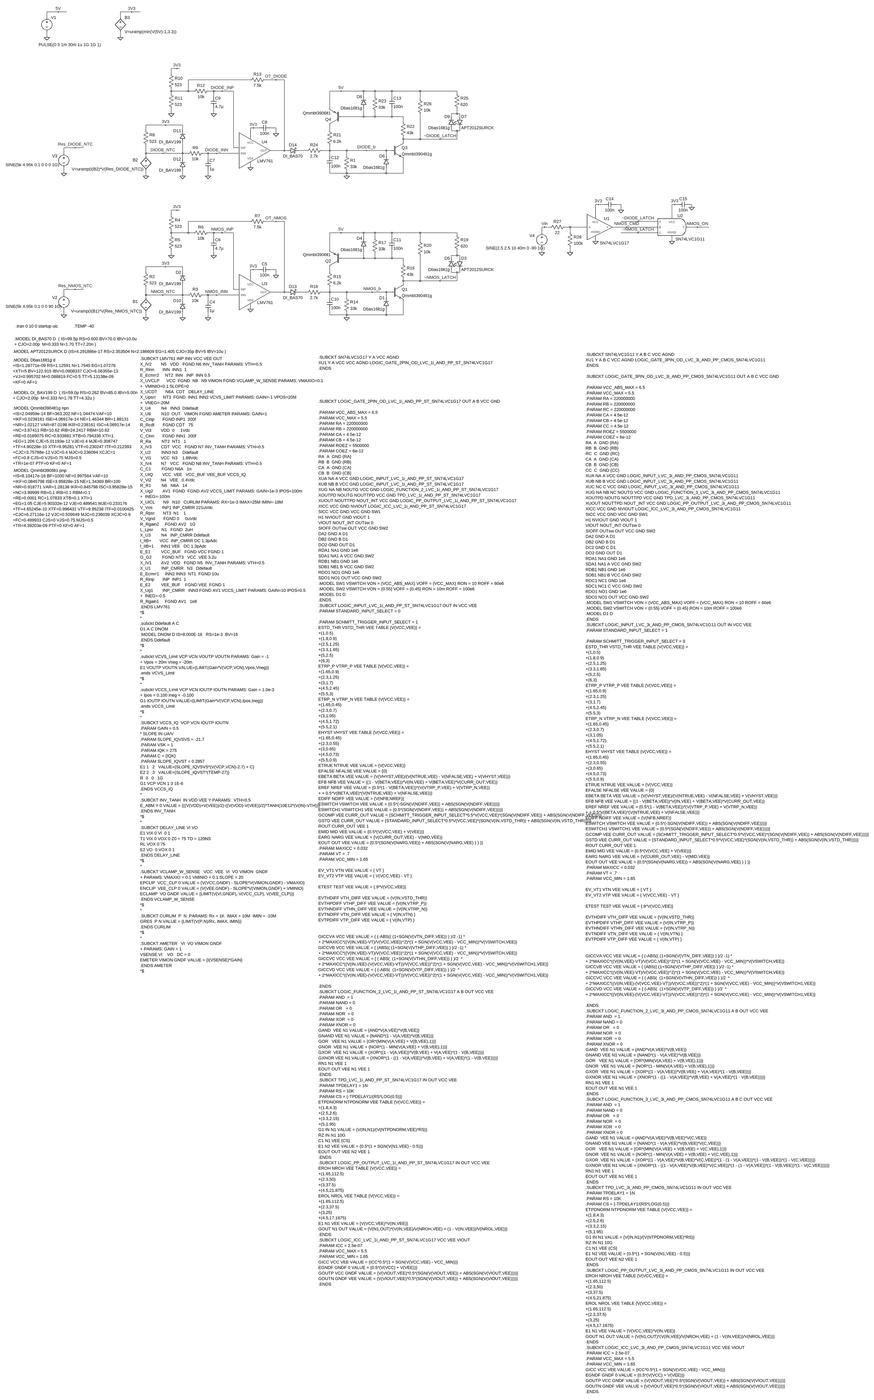
[diagram p0: schematic Big_Fast_Switch.asc, whole sheet]
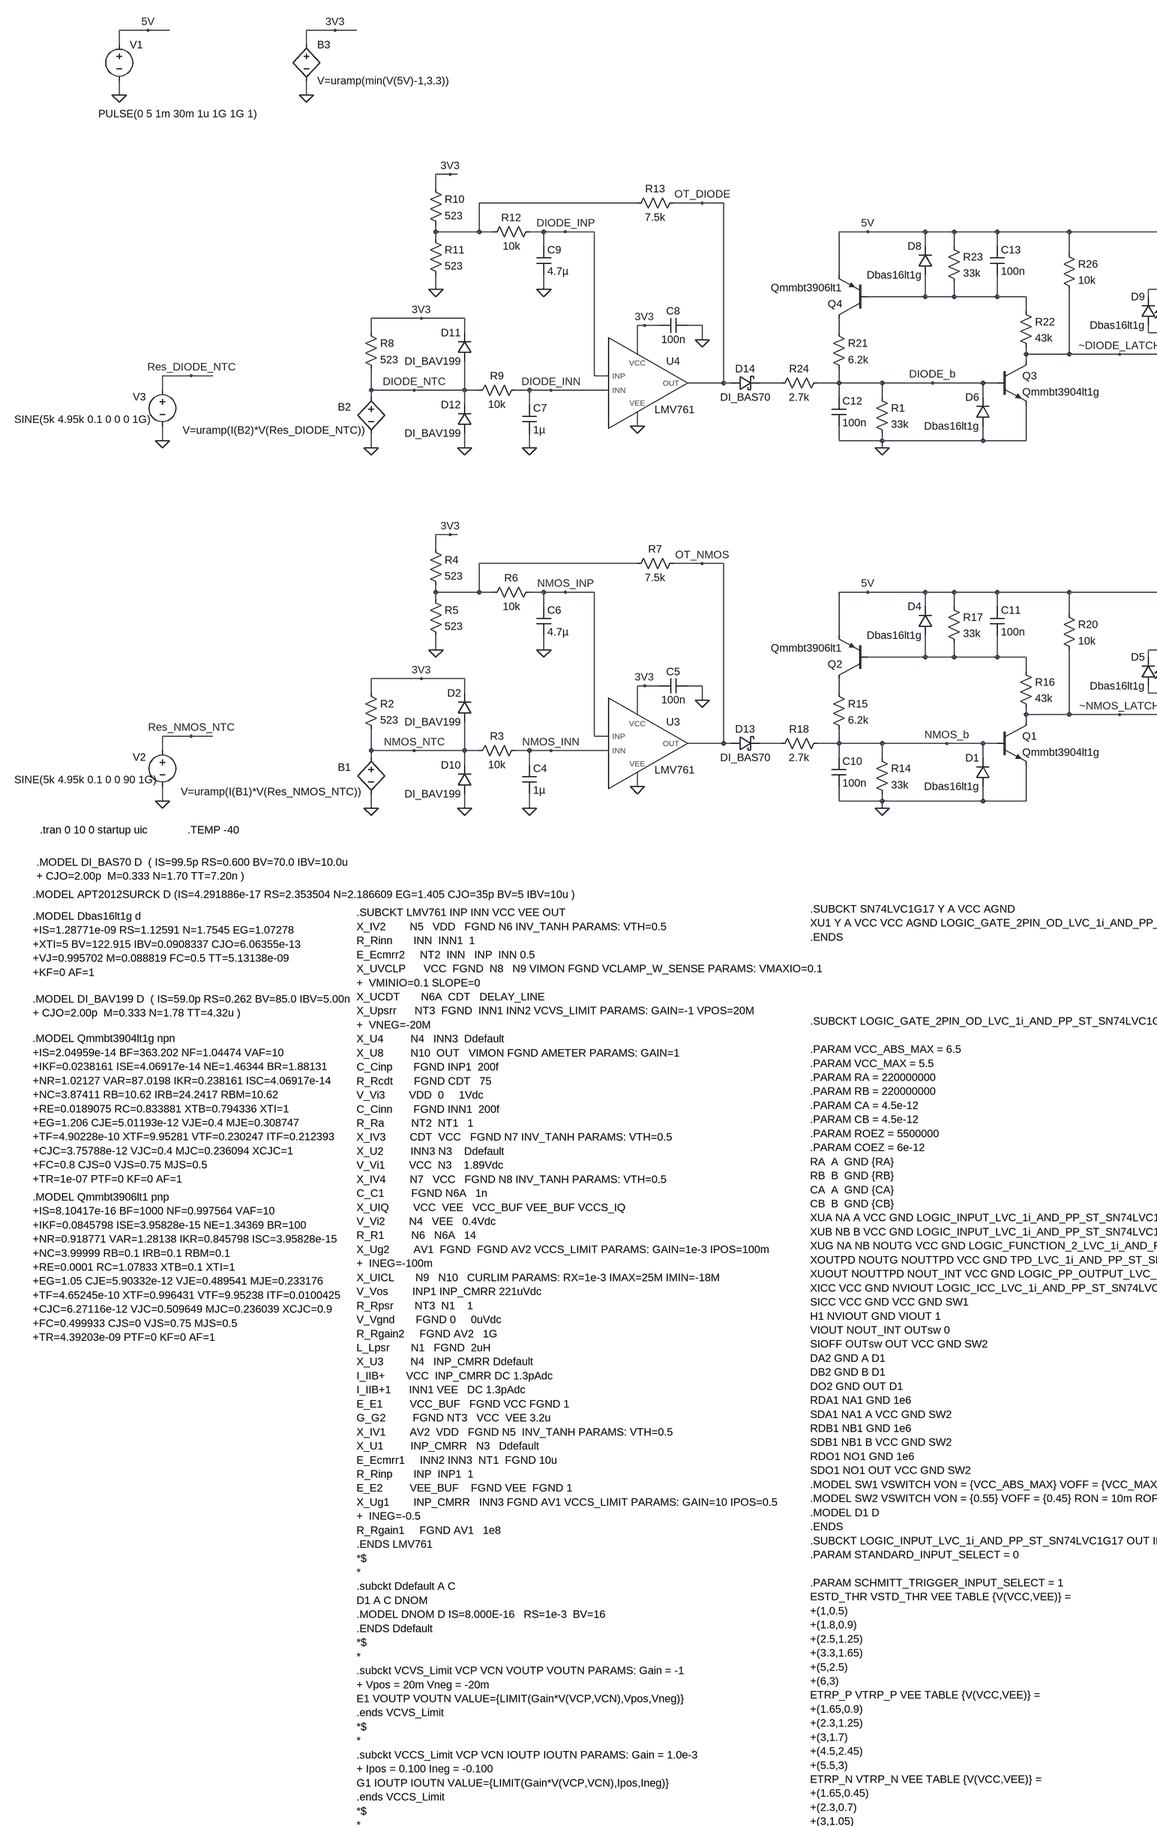
[diagram p1: schematic Big_Fast_Switch.asc, part, row 1 of 2, column 1 of 2]
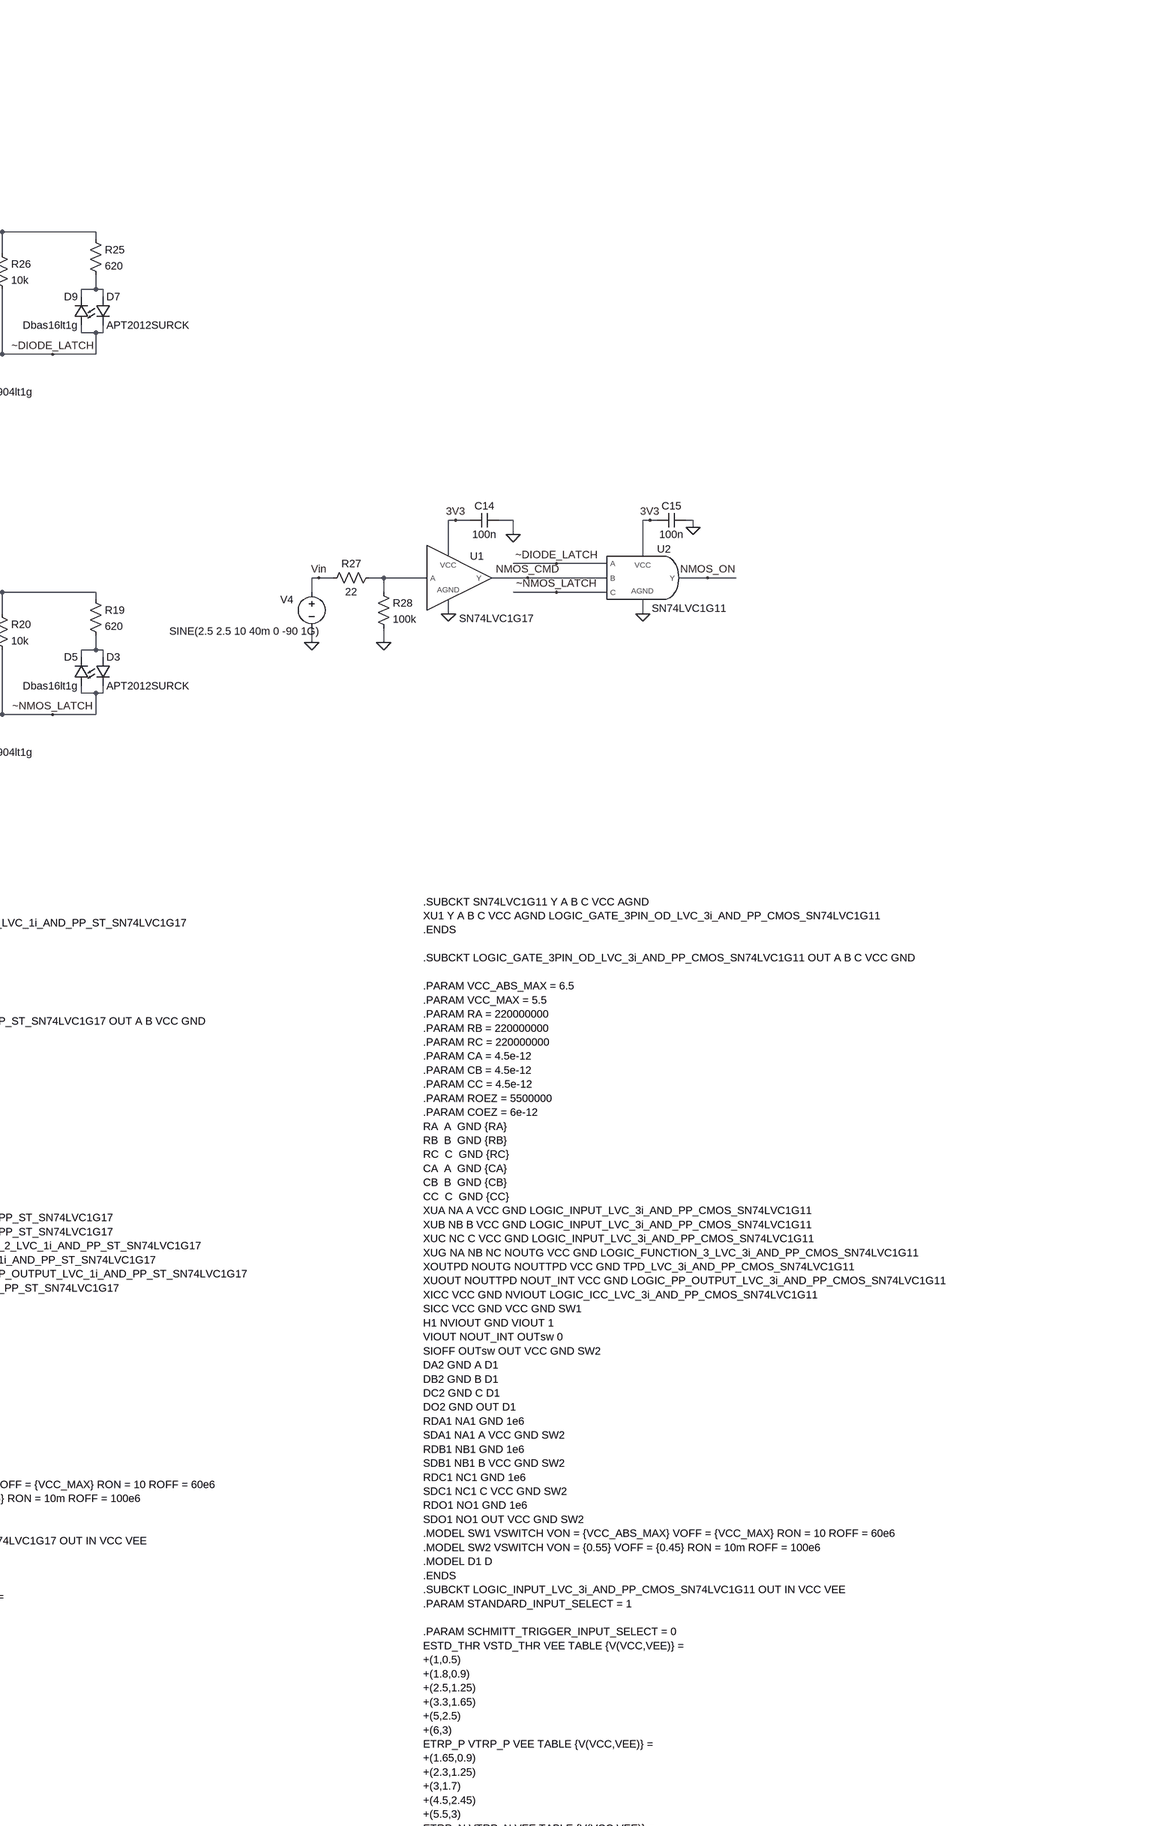
[diagram p2: schematic Big_Fast_Switch.asc, part, row 1 of 2, column 2 of 2]
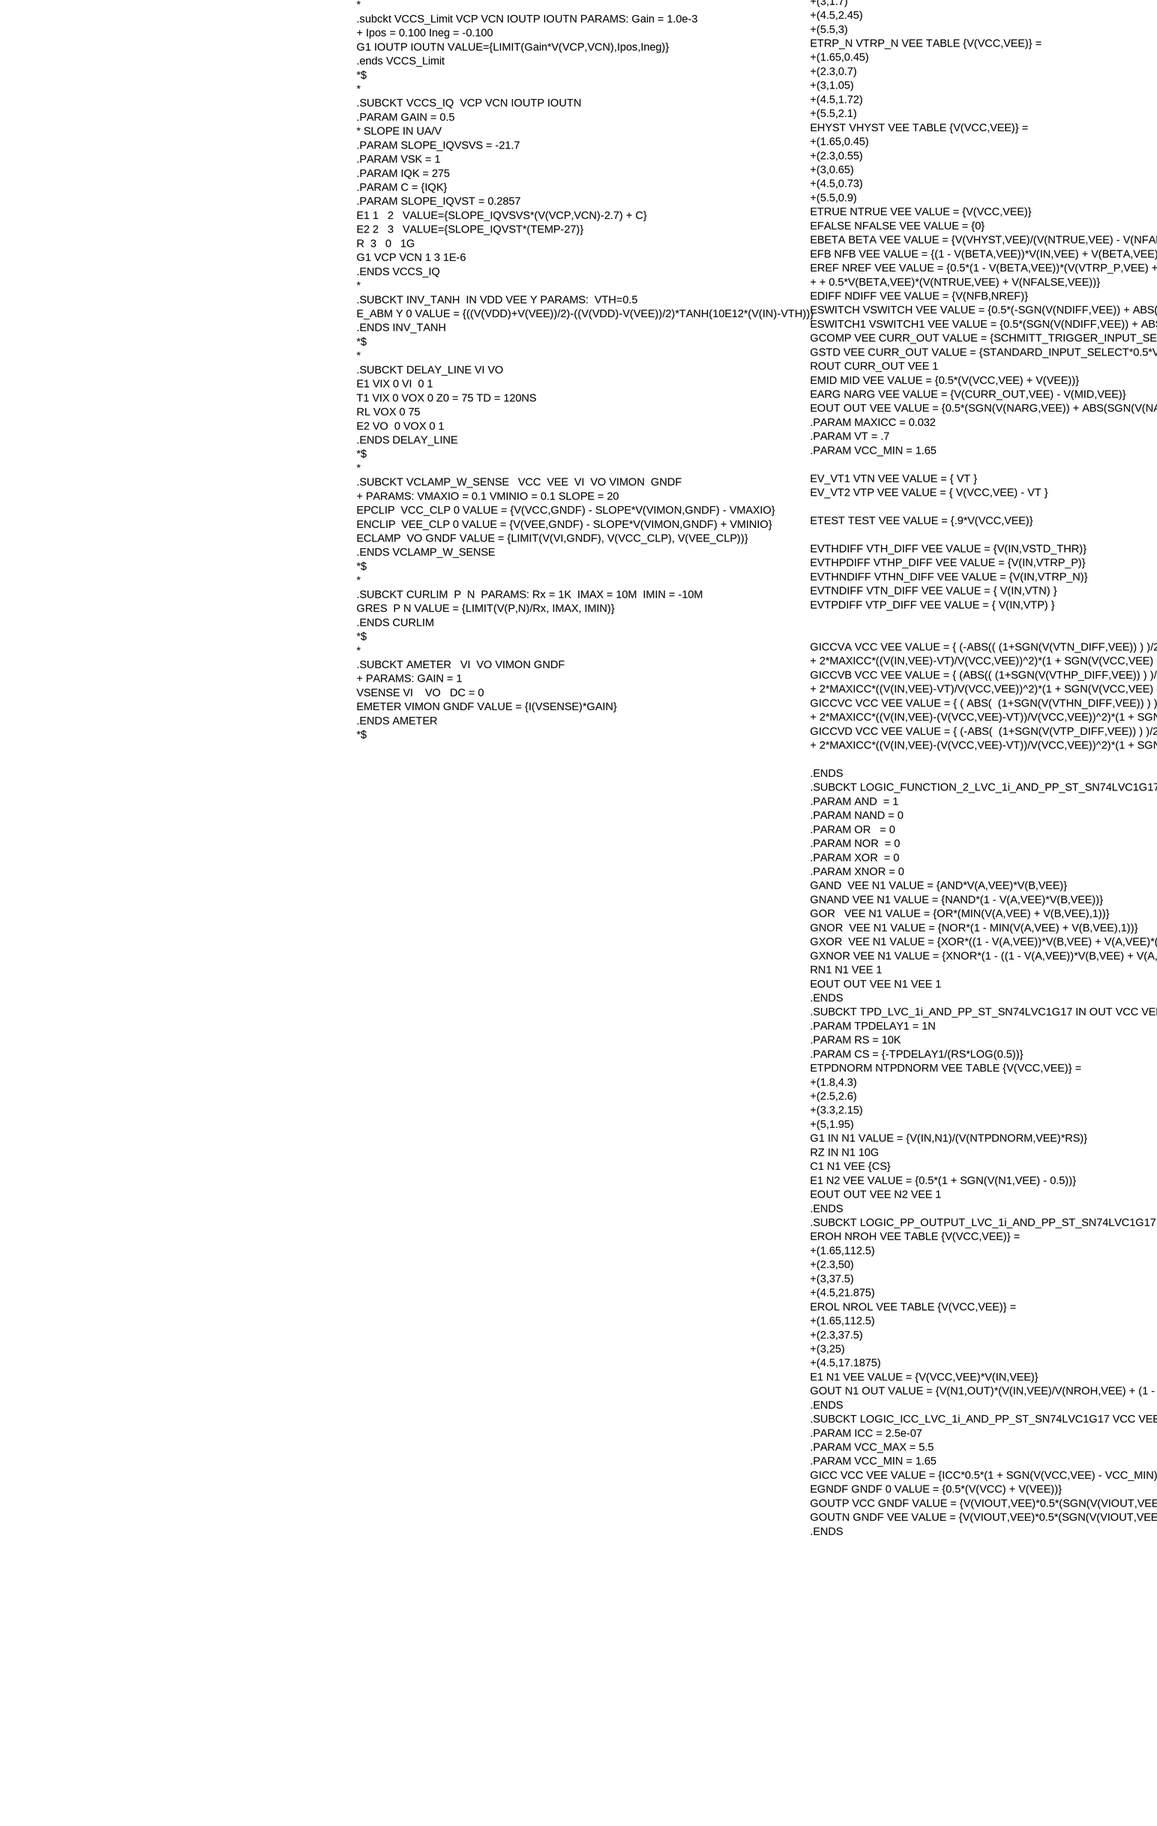
[diagram p3: schematic Big_Fast_Switch.asc, part, row 2 of 2, column 1 of 2]
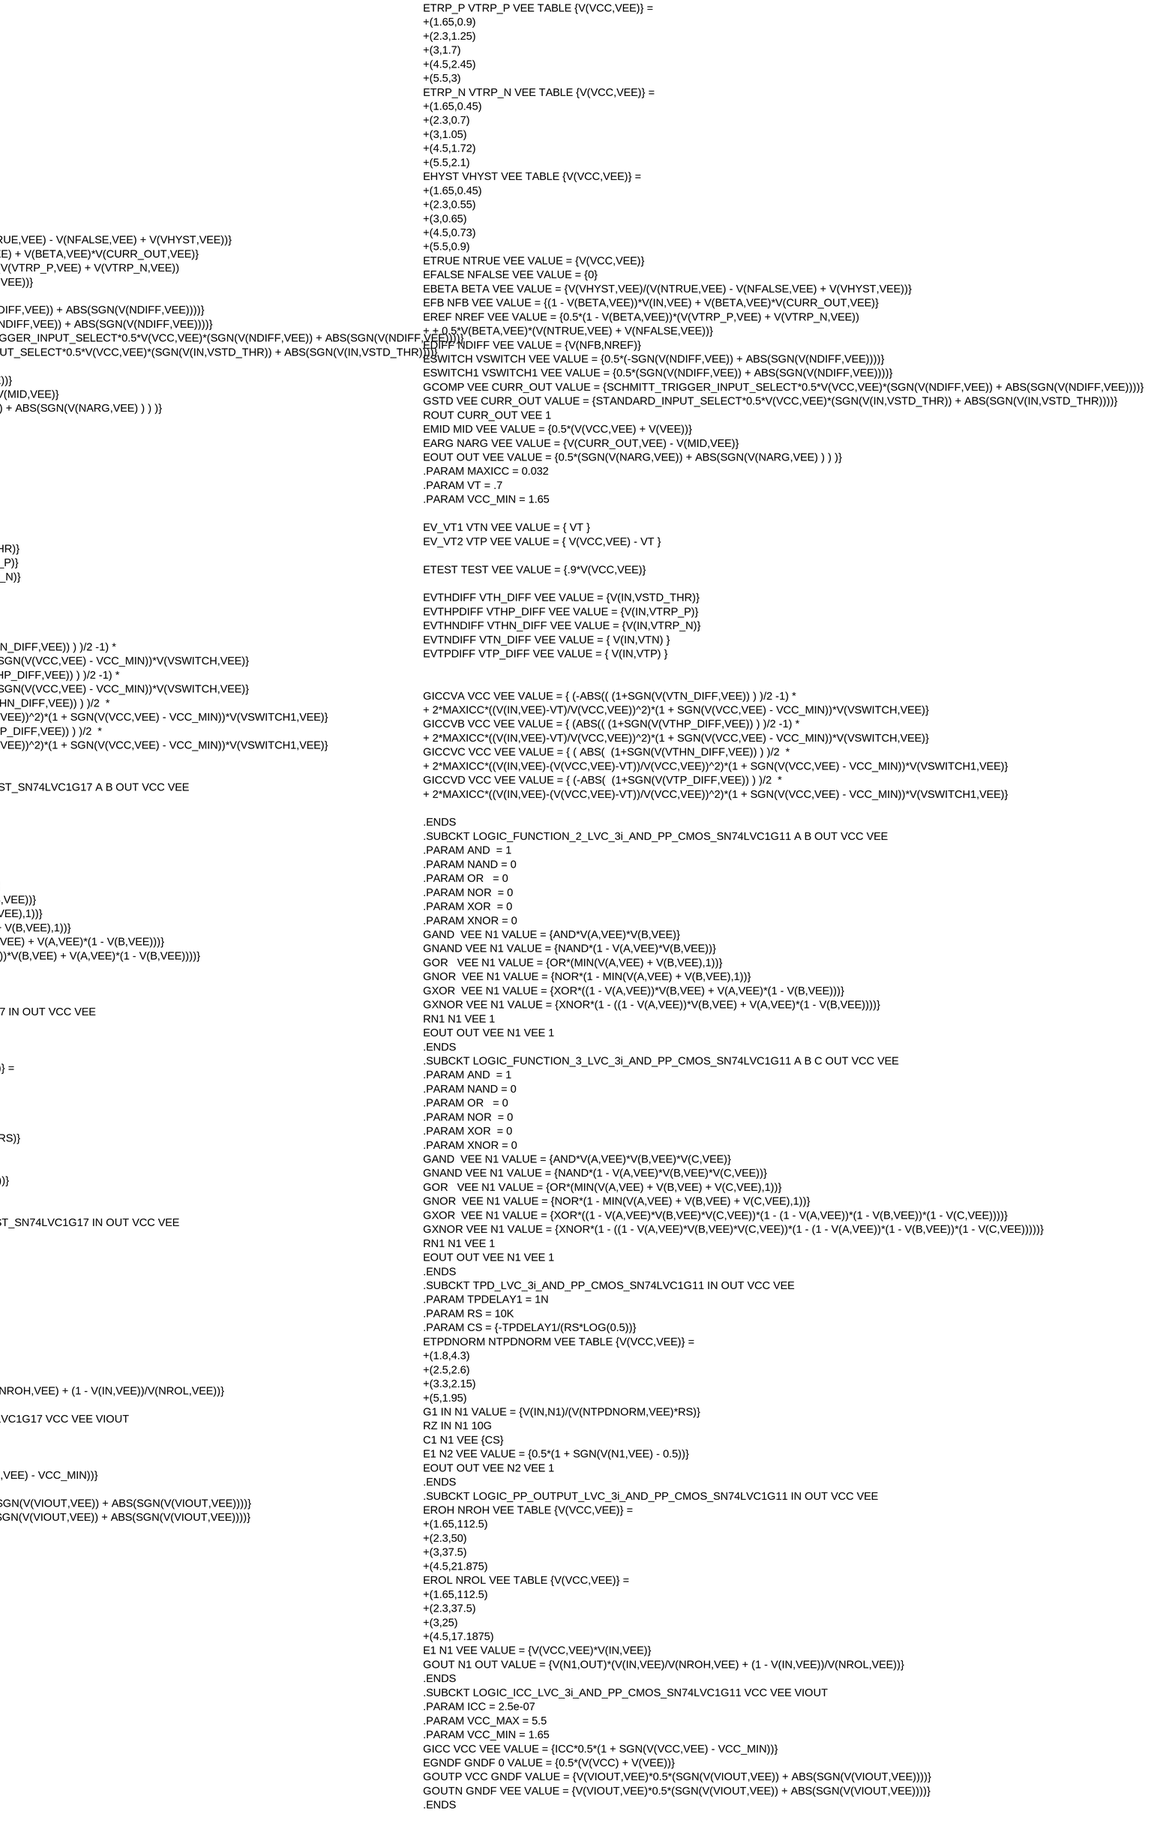
[diagram p4: schematic Big_Fast_Switch.asc, part, row 2 of 2, column 2 of 2]
* Big_Fast_Switch.asc
D1 0 NMOS_b Dbas16lt1g
D2 NMOS_NTC 3V3 DI_BAV199
Q1 ~NMOS_LATCH NMOS_b 0 0 Qmmbt3904lt1g
Q2 N010 N009 5V 0 Qmmbt3906lt1
D3 N008 ~NMOS_LATCH APT2012SURCK
D4 N009 5V Dbas16lt1g
D5 ~NMOS_LATCH N008 Dbas16lt1g
D10 0 NMOS_NTC DI_BAV199
V1 5V 0 PULSE(0 5 1m 30m 1u 1G 1G 1)
XU1 NMOS_CMD N007 3V3 0 SN74LVC1G17 SN74LVC1G17  ; pins Y A VCC AGND
XU2 NMOS_ON ~DIODE_LATCH NMOS_CMD ~NMOS_LATCH 3V3 0 SN74LVC1G11 SN74LVC1G11  ; pins Y A B C VCC AGND
XU3 NMOS_INP NMOS_INN 3V3 0 OT_NMOS LMV761 LMV761  ; pins INP INN VCC VEE OUT
B1 NMOS_NTC 0 V=uramp(I(B1)*V(Res_NMOS_NTC))
V2 Res_NMOS_NTC 0 SINE(5k 4.95k 0.1 0 0 90 1G)
R2 3V3 NMOS_NTC 523
R3 NMOS_INN NMOS_NTC 10k
C4 NMOS_INN 0 1µ
C5 0 3V3 100n
R4 3V3 N006 523
R5 N006 0 523
R6 NMOS_INP N006 10k
C6 NMOS_INP 0 4.7µ
R7 OT_NMOS N006 7.5k
D11 DIODE_NTC 3V3 DI_BAV199
D12 0 DIODE_NTC DI_BAV199
XU4 DIODE_INP DIODE_INN 3V3 0 OT_DIODE LMV761 LMV761  ; pins INP INN VCC VEE OUT
B2 DIODE_NTC 0 V=uramp(I(B2)*V(Res_DIODE_NTC))
V3 Res_DIODE_NTC 0 SINE(5k 4.95k 0.1 0 0 0 1G)
R8 3V3 DIODE_NTC 523
R9 DIODE_INN DIODE_NTC 10k
C7 DIODE_INN 0 1µ
C8 0 3V3 100n
R10 3V3 N001 523
R11 N001 0 523
R12 DIODE_INP N001 10k
C9 DIODE_INP 0 4.7µ
R13 OT_DIODE N001 7.5k
R14 NMOS_b 0 33k
C10 NMOS_b 0 100n
R15 N010 NMOS_b 6.2k
R16 N009 ~NMOS_LATCH 43k
R17 5V N009 33k
R18 NMOS_b N011 2.7k
C11 5V N009 100n
R19 5V N008 620
R20 5V ~NMOS_LATCH 10k
D6 0 DIODE_b Dbas16lt1g
Q3 ~DIODE_LATCH DIODE_b 0 0 Qmmbt3904lt1g
Q4 N004 N003 5V 0 Qmmbt3906lt1
D7 N002 ~DIODE_LATCH APT2012SURCK
D8 N003 5V Dbas16lt1g
D9 ~DIODE_LATCH N002 Dbas16lt1g
R1 DIODE_b 0 33k
C12 DIODE_b 0 100n
R21 N004 DIODE_b 6.2k
R22 N003 ~DIODE_LATCH 43k
R23 5V N003 33k
R24 DIODE_b N005 2.7k
C13 5V N003 100n
R25 5V N002 620
R26 5V ~DIODE_LATCH 10k
V4 Vin 0 SINE(2.5 2.5 10 40m 0 -90 1G)
R27 N007 Vin 22
R28 N007 0 100k
C14 0 3V3 100n
C15 0 3V3 100n
D13 OT_NMOS N011 DI_BAS70
D14 OT_DIODE N005 DI_BAS70
B3 3V3 0 V=uramp(min(V(5V)-1,3.3))
.model D D
.lib standard.dio
.model NPN NPN
.model PNP PNP
.lib standard.bjt
.MODEL Dbas16lt1g d
+IS=1.28771e-09 RS=1.12591 N=1.7545 EG=1.07278
+XTI=5 BV=122.915 IBV=0.0908337 CJO=6.06355e-13
+VJ=0.995702 M=0.088819 FC=0.5 TT=5.13138e-09
+KF=0 AF=1
.MODEL DI_BAV199 D  ( IS=59.0p RS=0.262 BV=85.0 IBV=5.00n
+ CJO=2.00p  M=0.333 N=1.78 TT=4.32u )
.MODEL Qmmbt3904lt1g npn
+IS=2.04959e-14 BF=363.202 NF=1.04474 VAF=10
+IKF=0.0238161 ISE=4.06917e-14 NE=1.46344 BR=1.88131
+NR=1.02127 VAR=87.0198 IKR=0.238161 ISC=4.06917e-14
+NC=3.87411 RB=10.62 IRB=24.2417 RBM=10.62
+RE=0.0189075 RC=0.833881 XTB=0.794336 XTI=1
+EG=1.206 CJE=5.01193e-12 VJE=0.4 MJE=0.308747
+TF=4.90228e-10 XTF=9.95281 VTF=0.230247 ITF=0.212393
+CJC=3.75788e-12 VJC=0.4 MJC=0.236094 XCJC=1
+FC=0.8 CJS=0 VJS=0.75 MJS=0.5
+TR=1e-07 PTF=0 KF=0 AF=1
.MODEL Qmmbt3906lt1 pnp
+IS=8.10417e-16 BF=1000 NF=0.997564 VAF=10
+IKF=0.0845798 ISE=3.95828e-15 NE=1.34369 BR=100
+NR=0.918771 VAR=1.28138 IKR=0.845798 ISC=3.95828e-15
+NC=3.99999 RB=0.1 IRB=0.1 RBM=0.1
+RE=0.0001 RC=1.07833 XTB=0.1 XTI=1
+EG=1.05 CJE=5.90332e-12 VJE=0.489541 MJE=0.233176
+TF=4.65245e-10 XTF=0.996431 VTF=9.95238 ITF=0.0100425
+CJC=6.27116e-12 VJC=0.509649 MJC=0.236039 XCJC=0.9
+FC=0.499933 CJS=0 VJS=0.75 MJS=0.5
+TR=4.39203e-09 PTF=0 KF=0 AF=1
.SUBCKT LMV761 INP INN VCC VEE OUT
X_IV2        N5   VDD   FGND N6 INV_TANH PARAMS: VTH=0.5
R_Rinn       INN  INN1  1
E_Ecmrr2     NT2  INN   INP  INN 0.5
X_UVCLP      VCC  FGND  N8   N9 VIMON FGND VCLAMP_W_SENSE PARAMS: VMAXIO=0.1
+  VMINIO=0.1 SLOPE=0
X_UCDT       N6A  CDT   DELAY_LINE
X_Upsrr      NT3  FGND  INN1 INN2 VCVS_LIMIT PARAMS: GAIN=-1 VPOS=20M
+  VNEG=-20M
X_U4         N4   INN3  Ddefault
X_U8         N10  OUT   VIMON FGND AMETER PARAMS: GAIN=1
C_Cinp       FGND INP1  200f
R_Rcdt       FGND CDT   75
V_Vi3        VDD  0     1Vdc
C_Cinn       FGND INN1  200f
R_Ra         NT2  NT1   1
X_IV3        CDT  VCC   FGND N7 INV_TANH PARAMS: VTH=0.5
X_U2         INN3 N3    Ddefault
V_Vi1        VCC  N3    1.89Vdc
X_IV4        N7   VCC   FGND N8 INV_TANH PARAMS: VTH=0.5
C_C1         FGND N6A   1n
X_UIQ        VCC  VEE   VCC_BUF VEE_BUF VCCS_IQ
V_Vi2        N4   VEE   0.4Vdc
R_R1         N6   N6A   14
X_Ug2        AV1  FGND  FGND AV2 VCCS_LIMIT PARAMS: GAIN=1e-3 IPOS=100m
+  INEG=-100m
X_UICL       N9   N10   CURLIM PARAMS: RX=1e-3 IMAX=25M IMIN=-18M
V_Vos        INP1 INP_CMRR 221uVdc
R_Rpsr       NT3  N1    1
V_Vgnd       FGND 0     0uVdc
R_Rgain2     FGND AV2   1G
L_Lpsr       N1   FGND  2uH
X_U3         N4   INP_CMRR Ddefault
I_IIB+       VCC  INP_CMRR DC 1.3pAdc
I_IIB+1      INN1 VEE   DC 1.3pAdc
E_E1         VCC_BUF   FGND VCC FGND 1
G_G2         FGND NT3   VCC  VEE 3.2u
X_IV1        AV2  VDD   FGND N5  INV_TANH PARAMS: VTH=0.5
X_U1         INP_CMRR   N3   Ddefault
E_Ecmrr1     INN2 INN3  NT1  FGND 10u
R_Rinp       INP  INP1  1
E_E2         VEE_BUF    FGND VEE  FGND 1
X_Ug1        INP_CMRR   INN3 FGND AV1 VCCS_LIMIT PARAMS: GAIN=10 IPOS=0.5
+  INEG=-0.5
R_Rgain1     FGND AV1   1e8
.ENDS LMV761
*$
*
.subckt Ddefault A C
D1 A C DNOM
.MODEL DNOM D IS=8.000E-16   RS=1e-3  BV=16
.ENDS Ddefault
*$
*
.subckt VCVS_Limit VCP VCN VOUTP VOUTN PARAMS: Gain = -1
+ Vpos = 20m Vneg = -20m
E1 VOUTP VOUTN VALUE={LIMIT(Gain*V(VCP,VCN),Vpos,Vneg)}
.ends VCVS_Limit
*$
*
.subckt VCCS_Limit VCP VCN IOUTP IOUTN PARAMS: Gain = 1.0e-3
+ Ipos = 0.100 Ineg = -0.100
G1 IOUTP IOUTN VALUE={LIMIT(Gain*V(VCP,VCN),Ipos,Ineg)}
.ends VCCS_Limit
*$
*
.SUBCKT VCCS_IQ  VCP VCN IOUTP IOUTN
.PARAM GAIN = 0.5
* SLOPE IN UA/V
.PARAM SLOPE_IQVSVS = -21.7
.PARAM VSK = 1
.PARAM IQK = 275
.PARAM C = {IQK}
.PARAM SLOPE_IQVST = 0.2857
E1 1   2   VALUE={SLOPE_IQVSVS*(V(VCP,VCN)-2.7) + C}
E2 2   3   VALUE={SLOPE_IQVST*(TEMP-27)}
R  3   0   1G
G1 VCP VCN 1 3 1E-6
.ENDS VCCS_IQ
*
.SUBCKT INV_TANH  IN VDD VEE Y PARAMS:  VTH=0.5
E_ABM Y 0 VALUE = {((V(VDD)+V(VEE))/2)-((V(VDD)-V(VEE))/2)*TANH(10E12*(V(IN)-VTH))}
.ENDS INV_TANH
*$
*
.SUBCKT DELAY_LINE VI VO
E1 VIX 0 VI  0 1
T1 VIX 0 VOX 0 Z0 = 75 TD = 120NS
RL VOX 0 75
E2 VO  0 VOX 0 1
.ENDS DELAY_LINE
*$
*
.SUBCKT VCLAMP_W_SENSE   VCC  VEE  VI  VO VIMON  GNDF
+ PARAMS: VMAXIO = 0.1 VMINIO = 0.1 SLOPE = 20
EPCLIP  VCC_CLP 0 VALUE = {V(VCC,GNDF) - SLOPE*V(VIMON,GNDF) - VMAXIO}
ENCLIP  VEE_CLP 0 VALUE = {V(VEE,GNDF) - SLOPE*V(VIMON,GNDF) + VMINIO}
ECLAMP  VO GNDF VALUE = {LIMIT(V(VI,GNDF), V(VCC_CLP), V(VEE_CLP))}
.ENDS VCLAMP_W_SENSE
*$
*
.SUBCKT CURLIM  P  N  PARAMS: Rx = 1K  IMAX = 10M  IMIN = -10M
GRES  P N VALUE = {LIMIT(V(P,N)/Rx, IMAX, IMIN)}
.ENDS CURLIM
*$
*
.SUBCKT AMETER   VI  VO VIMON GNDF
+ PARAMS: GAIN = 1
VSENSE VI    VO   DC = 0
EMETER VIMON GNDF VALUE = {I(VSENSE)*GAIN}
.ENDS AMETER
*$
.SUBCKT SN74LVC1G17 Y A VCC AGND
XU1 Y A VCC VCC AGND LOGIC_GATE_2PIN_OD_LVC_1i_AND_PP_ST_SN74LVC1G17
.ENDS
.SUBCKT LOGIC_GATE_2PIN_OD_LVC_1i_AND_PP_ST_SN74LVC1G17 OUT A B VCC GND
.PARAM VCC_ABS_MAX = 6.5
.PARAM VCC_MAX = 5.5
.PARAM RA = 220000000
.PARAM RB = 220000000
.PARAM CA = 4.5e-12
.PARAM CB = 4.5e-12
.PARAM ROEZ = 5500000
.PARAM COEZ = 6e-12
RA  A  GND {RA}
RB  B  GND {RB}
CA  A  GND {CA}
CB  B  GND {CB}
XUA NA A VCC GND LOGIC_INPUT_LVC_1i_AND_PP_ST_SN74LVC1G17
XUB NB B VCC GND LOGIC_INPUT_LVC_1i_AND_PP_ST_SN74LVC1G17
XUG NA NB NOUTG VCC GND LOGIC_FUNCTION_2_LVC_1i_AND_PP_ST_SN74LVC1G17
XOUTPD NOUTG NOUTTPD VCC GND TPD_LVC_1i_AND_PP_ST_SN74LVC1G17
XUOUT NOUTTPD NOUT_INT VCC GND LOGIC_PP_OUTPUT_LVC_1i_AND_PP_ST_SN74LVC1G17
XICC VCC GND NVIOUT LOGIC_ICC_LVC_1i_AND_PP_ST_SN74LVC1G17
SICC VCC GND VCC GND SW1
H1 NVIOUT GND VIOUT 1
VIOUT NOUT_INT OUTsw 0
SIOFF OUTsw OUT VCC GND SW2
DA2 GND A D1
DB2 GND B D1
DO2 GND OUT D1
RDA1 NA1 GND 1e6
SDA1 NA1 A VCC GND SW2
RDB1 NB1 GND 1e6
SDB1 NB1 B VCC GND SW2
RDO1 NO1 GND 1e6
SDO1 NO1 OUT VCC GND SW2
.MODEL SW1 VSWITCH VON = {VCC_ABS_MAX} VOFF = {VCC_MAX} RON = 10 ROFF = 60e6
.MODEL SW2 VSWITCH VON = {0.55} VOFF = {0.45} RON = 10m ROFF = 100e6
.MODEL D1 D
.ENDS
.SUBCKT LOGIC_INPUT_LVC_1i_AND_PP_ST_SN74LVC1G17 OUT IN VCC VEE
.PARAM STANDARD_INPUT_SELECT = 0
.PARAM SCHMITT_TRIGGER_INPUT_SELECT = 1
ESTD_THR VSTD_THR VEE TABLE {V(VCC,VEE)} =
+(1,0.5)
+(1.8,0.9)
+(2.5,1.25)
+(3.3,1.65)
+(5,2.5)
+(6,3)
ETRP_P VTRP_P VEE TABLE {V(VCC,VEE)} =
+(1.65,0.9)
+(2.3,1.25)
+(3,1.7)
+(4.5,2.45)
+(5.5,3)
ETRP_N VTRP_N VEE TABLE {V(VCC,VEE)} =
+(1.65,0.45)
+(2.3,0.7)
+(3,1.05)
+(4.5,1.72)
+(5.5,2.1)
EHYST VHYST VEE TABLE {V(VCC,VEE)} =
+(1.65,0.45)
+(2.3,0.55)
+(3,0.65)
+(4.5,0.73)
+(5.5,0.9)
ETRUE NTRUE VEE VALUE = {V(VCC,VEE)}
EFALSE NFALSE VEE VALUE = {0}
EBETA BETA VEE VALUE = {V(VHYST,VEE)/(V(NTRUE,VEE) - V(NFALSE,VEE) + V(VHYST,VEE))}
EFB NFB VEE VALUE = {(1 - V(BETA,VEE))*V(IN,VEE) + V(BETA,VEE)*V(CURR_OUT,VEE)}
EREF NREF VEE VALUE = {0.5*(1 - V(BETA,VEE))*(V(VTRP_P,VEE) + V(VTRP_N,VEE))
+ + 0.5*V(BETA,VEE)*(V(NTRUE,VEE) + V(NFALSE,VEE))}
EDIFF NDIFF VEE VALUE = {V(NFB,NREF)}
ESWITCH VSWITCH VEE VALUE = {0.5*(-SGN(V(NDIFF,VEE)) + ABS(SGN(V(NDIFF,VEE))))}
ESWITCH1 VSWITCH1 VEE VALUE = {0.5*(SGN(V(NDIFF,VEE)) + ABS(SGN(V(NDIFF,VEE))))}
GCOMP VEE CURR_OUT VALUE = {SCHMITT_TRIGGER_INPUT_SELECT*0.5*V(VCC,VEE)*(SGN(V(NDIFF,VEE)) + ABS(SGN(V(NDIFF,VEE))))}
GSTD VEE CURR_OUT VALUE = {STANDARD_INPUT_SELECT*0.5*V(VCC,VEE)*(SGN(V(IN,VSTD_THR)) + ABS(SGN(V(IN,VSTD_THR))))}
ROUT CURR_OUT VEE 1
EMID MID VEE VALUE = {0.5*(V(VCC,VEE) + V(VEE))}
EARG NARG VEE VALUE = {V(CURR_OUT,VEE) - V(MID,VEE)}
EOUT OUT VEE VALUE = {0.5*(SGN(V(NARG,VEE)) + ABS(SGN(V(NARG,VEE) ) ) )}
.PARAM MAXICC = 0.032
.PARAM VT = .7
.PARAM VCC_MIN = 1.65
EV_VT1 VTN VEE VALUE = { VT }
EV_VT2 VTP VEE VALUE = { V(VCC,VEE) - VT }
ETEST TEST VEE VALUE = {.9*V(VCC,VEE)}
EVTHDIFF VTH_DIFF VEE VALUE = {V(IN,VSTD_THR)}
EVTHPDIFF VTHP_DIFF VEE VALUE = {V(IN,VTRP_P)}
EVTHNDIFF VTHN_DIFF VEE VALUE = {V(IN,VTRP_N)}
EVTNDIFF VTN_DIFF VEE VALUE = { V(IN,VTN) }
EVTPDIFF VTP_DIFF VEE VALUE = { V(IN,VTP) }
GICCVA VCC VEE VALUE = { (-ABS(( (1+SGN(V(VTN_DIFF,VEE)) ) )/2 -1) *
+ 2*MAXICC*((V(IN,VEE)-VT)/V(VCC,VEE))^2)*(1 + SGN(V(VCC,VEE) - VCC_MIN))*V(VSWITCH,VEE)}
GICCVB VCC VEE VALUE = { (ABS(( (1+SGN(V(VTHP_DIFF,VEE)) ) )/2 -1) *
+ 2*MAXICC*((V(IN,VEE)-VT)/V(VCC,VEE))^2)*(1 + SGN(V(VCC,VEE) - VCC_MIN))*V(VSWITCH,VEE)}
GICCVC VCC VEE VALUE = { ( ABS(  (1+SGN(V(VTHN_DIFF,VEE)) ) )/2  *
+ 2*MAXICC*((V(IN,VEE)-(V(VCC,VEE)-VT))/V(VCC,VEE))^2)*(1 + SGN(V(VCC,VEE) - VCC_MIN))*V(VSWITCH1,VEE)}
GICCVD VCC VEE VALUE = { (-ABS(  (1+SGN(V(VTP_DIFF,VEE)) ) )/2  *
+ 2*MAXICC*((V(IN,VEE)-(V(VCC,VEE)-VT))/V(VCC,VEE))^2)*(1 + SGN(V(VCC,VEE) - VCC_MIN))*V(VSWITCH1,VEE)}
.ENDS
.SUBCKT LOGIC_FUNCTION_2_LVC_1i_AND_PP_ST_SN74LVC1G17 A B OUT VCC VEE
.PARAM AND  = 1
.PARAM NAND = 0
.PARAM OR   = 0
.PARAM NOR  = 0
.PARAM XOR  = 0
.PARAM XNOR = 0
GAND  VEE N1 VALUE = {AND*V(A,VEE)*V(B,VEE)}
GNAND VEE N1 VALUE = {NAND*(1 - V(A,VEE)*V(B,VEE))}
GOR   VEE N1 VALUE = {OR*(MIN(V(A,VEE) + V(B,VEE),1))}
GNOR  VEE N1 VALUE = {NOR*(1 - MIN(V(A,VEE) + V(B,VEE),1))}
GXOR  VEE N1 VALUE = {XOR*((1 - V(A,VEE))*V(B,VEE) + V(A,VEE)*(1 - V(B,VEE)))}
GXNOR VEE N1 VALUE = {XNOR*(1 - ((1 - V(A,VEE))*V(B,VEE) + V(A,VEE)*(1 - V(B,VEE))))}
RN1 N1 VEE 1
EOUT OUT VEE N1 VEE 1
.ENDS
.SUBCKT TPD_LVC_1i_AND_PP_ST_SN74LVC1G17 IN OUT VCC VEE
.PARAM TPDELAY1 = 1N
.PARAM RS = 10K
.PARAM CS = {-TPDELAY1/(RS*LOG(0.5))}
ETPDNORM NTPDNORM VEE TABLE {V(VCC,VEE)} =
+(1.8,4.3)
+(2.5,2.6)
+(3.3,2.15)
+(5,1.95)
G1 IN N1 VALUE = {V(IN,N1)/(V(NTPDNORM,VEE)*RS)}
RZ IN N1 10G
C1 N1 VEE {CS}
E1 N2 VEE VALUE = {0.5*(1 + SGN(V(N1,VEE) - 0.5))}
EOUT OUT VEE N2 VEE 1
.ENDS
.SUBCKT LOGIC_PP_OUTPUT_LVC_1i_AND_PP_ST_SN74LVC1G17 IN OUT VCC VEE
EROH NROH VEE TABLE {V(VCC,VEE)} =
+(1.65,112.5)
+(2.3,50)
+(3,37.5)
+(4.5,21.875)
EROL NROL VEE TABLE {V(VCC,VEE)} =
+(1.65,112.5)
+(2.3,37.5)
+(3,25)
+(4.5,17.1875)
E1 N1 VEE VALUE = {V(VCC,VEE)*V(IN,VEE)}
GOUT N1 OUT VALUE = {V(N1,OUT)*(V(IN,VEE)/V(NROH,VEE) + (1 - V(IN,VEE))/V(NROL,VEE))}
.ENDS
.SUBCKT LOGIC_ICC_LVC_1i_AND_PP_ST_SN74LVC1G17 VCC VEE VIOUT
.PARAM ICC = 2.5e-07
.PARAM VCC_MAX = 5.5
.PARAM VCC_MIN = 1.65
GICC VCC VEE VALUE = {ICC*0.5*(1 + SGN(V(VCC,VEE) - VCC_MIN))}
EGNDF GNDF 0 VALUE = {0.5*(V(VCC) + V(VEE))}
GOUTP VCC GNDF VALUE = {V(VIOUT,VEE)*0.5*(SGN(V(VIOUT,VEE)) + ABS(SGN(V(VIOUT,VEE))))}
GOUTN GNDF VEE VALUE = {V(VIOUT,VEE)*0.5*(SGN(V(VIOUT,VEE)) + ABS(SGN(V(VIOUT,VEE))))}
.ENDS
.SUBCKT SN74LVC1G11 Y A B C VCC AGND
XU1 Y A B C VCC AGND LOGIC_GATE_3PIN_OD_LVC_3i_AND_PP_CMOS_SN74LVC1G11
.ENDS
.SUBCKT LOGIC_GATE_3PIN_OD_LVC_3i_AND_PP_CMOS_SN74LVC1G11 OUT A B C VCC GND
.PARAM VCC_ABS_MAX = 6.5
.PARAM VCC_MAX = 5.5
.PARAM RA = 220000000
.PARAM RB = 220000000
.PARAM RC = 220000000
.PARAM CA = 4.5e-12
.PARAM CB = 4.5e-12
.PARAM CC = 4.5e-12
.PARAM ROEZ = 5500000
.PARAM COEZ = 6e-12
RA  A  GND {RA}
RB  B  GND {RB}
RC  C  GND {RC}
CA  A  GND {CA}
CB  B  GND {CB}
CC  C  GND {CC}
XUA NA A VCC GND LOGIC_INPUT_LVC_3i_AND_PP_CMOS_SN74LVC1G11
XUB NB B VCC GND LOGIC_INPUT_LVC_3i_AND_PP_CMOS_SN74LVC1G11
XUC NC C VCC GND LOGIC_INPUT_LVC_3i_AND_PP_CMOS_SN74LVC1G11
XUG NA NB NC NOUTG VCC GND LOGIC_FUNCTION_3_LVC_3i_AND_PP_CMOS_SN74LVC1G11
XOUTPD NOUTG NOUTTPD VCC GND TPD_LVC_3i_AND_PP_CMOS_SN74LVC1G11
XUOUT NOUTTPD NOUT_INT VCC GND LOGIC_PP_OUTPUT_LVC_3i_AND_PP_CMOS_SN74LVC1G11
XICC VCC GND NVIOUT LOGIC_ICC_LVC_3i_AND_PP_CMOS_SN74LVC1G11
SICC VCC GND VCC GND SW1
H1 NVIOUT GND VIOUT 1
VIOUT NOUT_INT OUTsw 0
SIOFF OUTsw OUT VCC GND SW2
DA2 GND A D1
DB2 GND B D1
DC2 GND C D1
DO2 GND OUT D1
RDA1 NA1 GND 1e6
SDA1 NA1 A VCC GND SW2
RDB1 NB1 GND 1e6
SDB1 NB1 B VCC GND SW2
RDC1 NC1 GND 1e6
SDC1 NC1 C VCC GND SW2
RDO1 NO1 GND 1e6
SDO1 NO1 OUT VCC GND SW2
.MODEL SW1 VSWITCH VON = {VCC_ABS_MAX} VOFF = {VCC_MAX} RON = 10 ROFF = 60e6
.MODEL SW2 VSWITCH VON = {0.55} VOFF = {0.45} RON = 10m ROFF = 100e6
.MODEL D1 D
.ENDS
.SUBCKT LOGIC_INPUT_LVC_3i_AND_PP_CMOS_SN74LVC1G11 OUT IN VCC VEE
.PARAM STANDARD_INPUT_SELECT = 1
.PARAM SCHMITT_TRIGGER_INPUT_SELECT = 0
ESTD_THR VSTD_THR VEE TABLE {V(VCC,VEE)} =
+(1,0.5)
+(1.8,0.9)
+(2.5,1.25)
+(3.3,1.65)
+(5,2.5)
+(6,3)
ETRP_P VTRP_P VEE TABLE {V(VCC,VEE)} =
+(1.65,0.9)
+(2.3,1.25)
+(3,1.7)
+(4.5,2.45)
+(5.5,3)
ETRP_N VTRP_N VEE TABLE {V(VCC,VEE)} =
+(1.65,0.45)
+(2.3,0.7)
+(3,1.05)
+(4.5,1.72)
+(5.5,2.1)
EHYST VHYST VEE TABLE {V(VCC,VEE)} =
+(1.65,0.45)
+(2.3,0.55)
+(3,0.65)
+(4.5,0.73)
+(5.5,0.9)
ETRUE NTRUE VEE VALUE = {V(VCC,VEE)}
EFALSE NFALSE VEE VALUE = {0}
EBETA BETA VEE VALUE = {V(VHYST,VEE)/(V(NTRUE,VEE) - V(NFALSE,VEE) + V(VHYST,VEE))}
EFB NFB VEE VALUE = {(1 - V(BETA,VEE))*V(IN,VEE) + V(BETA,VEE)*V(CURR_OUT,VEE)}
EREF NREF VEE VALUE = {0.5*(1 - V(BETA,VEE))*(V(VTRP_P,VEE) + V(VTRP_N,VEE))
+ + 0.5*V(BETA,VEE)*(V(NTRUE,VEE) + V(NFALSE,VEE))}
EDIFF NDIFF VEE VALUE = {V(NFB,NREF)}
ESWITCH VSWITCH VEE VALUE = {0.5*(-SGN(V(NDIFF,VEE)) + ABS(SGN(V(NDIFF,VEE))))}
ESWITCH1 VSWITCH1 VEE VALUE = {0.5*(SGN(V(NDIFF,VEE)) + ABS(SGN(V(NDIFF,VEE))))}
GCOMP VEE CURR_OUT VALUE = {SCHMITT_TRIGGER_INPUT_SELECT*0.5*V(VCC,VEE)*(SGN(V(NDIFF,VEE)) + ABS(SGN(V(NDIFF,VEE))))}
GSTD VEE CURR_OUT VALUE = {STANDARD_INPUT_SELECT*0.5*V(VCC,VEE)*(SGN(V(IN,VSTD_THR)) + ABS(SGN(V(IN,VSTD_THR))))}
ROUT CURR_OUT VEE 1
EMID MID VEE VALUE = {0.5*(V(VCC,VEE) + V(VEE))}
EARG NARG VEE VALUE = {V(CURR_OUT,VEE) - V(MID,VEE)}
EOUT OUT VEE VALUE = {0.5*(SGN(V(NARG,VEE)) + ABS(SGN(V(NARG,VEE) ) ) )}
.PARAM MAXICC = 0.032
.PARAM VT = .7
.PARAM VCC_MIN = 1.65
EV_VT1 VTN VEE VALUE = { VT }
EV_VT2 VTP VEE VALUE = { V(VCC,VEE) - VT }
ETEST TEST VEE VALUE = {.9*V(VCC,VEE)}
EVTHDIFF VTH_DIFF VEE VALUE = {V(IN,VSTD_THR)}
EVTHPDIFF VTHP_DIFF VEE VALUE = {V(IN,VTRP_P)}
EVTHNDIFF VTHN_DIFF VEE VALUE = {V(IN,VTRP_N)}
EVTNDIFF VTN_DIFF VEE VALUE = { V(IN,VTN) }
EVTPDIFF VTP_DIFF VEE VALUE = { V(IN,VTP) }
GICCVA VCC VEE VALUE = { (-ABS(( (1+SGN(V(VTN_DIFF,VEE)) ) )/2 -1) *
+ 2*MAXICC*((V(IN,VEE)-VT)/V(VCC,VEE))^2)*(1 + SGN(V(VCC,VEE) - VCC_MIN))*V(VSWITCH,VEE)}
GICCVB VCC VEE VALUE = { (ABS(( (1+SGN(V(VTHP_DIFF,VEE)) ) )/2 -1) *
+ 2*MAXICC*((V(IN,VEE)-VT)/V(VCC,VEE))^2)*(1 + SGN(V(VCC,VEE) - VCC_MIN))*V(VSWITCH,VEE)}
GICCVC VCC VEE VALUE = { ( ABS(  (1+SGN(V(VTHN_DIFF,VEE)) ) )/2  *
+ 2*MAXICC*((V(IN,VEE)-(V(VCC,VEE)-VT))/V(VCC,VEE))^2)*(1 + SGN(V(VCC,VEE) - VCC_MIN))*V(VSWITCH1,VEE)}
GICCVD VCC VEE VALUE = { (-ABS(  (1+SGN(V(VTP_DIFF,VEE)) ) )/2  *
+ 2*MAXICC*((V(IN,VEE)-(V(VCC,VEE)-VT))/V(VCC,VEE))^2)*(1 + SGN(V(VCC,VEE) - VCC_MIN))*V(VSWITCH1,VEE)}
.ENDS
.SUBCKT LOGIC_FUNCTION_2_LVC_3i_AND_PP_CMOS_SN74LVC1G11 A B OUT VCC VEE
.PARAM AND  = 1
.PARAM NAND = 0
.PARAM OR   = 0
.PARAM NOR  = 0
.PARAM XOR  = 0
.PARAM XNOR = 0
GAND  VEE N1 VALUE = {AND*V(A,VEE)*V(B,VEE)}
GNAND VEE N1 VALUE = {NAND*(1 - V(A,VEE)*V(B,VEE))}
GOR   VEE N1 VALUE = {OR*(MIN(V(A,VEE) + V(B,VEE),1))}
GNOR  VEE N1 VALUE = {NOR*(1 - MIN(V(A,VEE) + V(B,VEE),1))}
GXOR  VEE N1 VALUE = {XOR*((1 - V(A,VEE))*V(B,VEE) + V(A,VEE)*(1 - V(B,VEE)))}
GXNOR VEE N1 VALUE = {XNOR*(1 - ((1 - V(A,VEE))*V(B,VEE) + V(A,VEE)*(1 - V(B,VEE))))}
RN1 N1 VEE 1
EOUT OUT VEE N1 VEE 1
.ENDS
.SUBCKT LOGIC_FUNCTION_3_LVC_3i_AND_PP_CMOS_SN74LVC1G11 A B C OUT VCC VEE
.PARAM AND  = 1
.PARAM NAND = 0
.PARAM OR   = 0
.PARAM NOR  = 0
.PARAM XOR  = 0
.PARAM XNOR = 0
GAND  VEE N1 VALUE = {AND*V(A,VEE)*V(B,VEE)*V(C,VEE)}
GNAND VEE N1 VALUE = {NAND*(1 - V(A,VEE)*V(B,VEE)*V(C,VEE))}
GOR   VEE N1 VALUE = {OR*(MIN(V(A,VEE) + V(B,VEE) + V(C,VEE),1))}
GNOR  VEE N1 VALUE = {NOR*(1 - MIN(V(A,VEE) + V(B,VEE) + V(C,VEE),1))}
GXOR  VEE N1 VALUE = {XOR*((1 - V(A,VEE)*V(B,VEE)*V(C,VEE))*(1 - (1 - V(A,VEE))*(1 - V(B,VEE))*(1 - V(C,VEE))))}
GXNOR VEE N1 VALUE = {XNOR*(1 - ((1 - V(A,VEE)*V(B,VEE)*V(C,VEE))*(1 - (1 - V(A,VEE))*(1 - V(B,VEE))*(1 - V(C,VEE)))))}
RN1 N1 VEE 1
EOUT OUT VEE N1 VEE 1
.ENDS
.SUBCKT TPD_LVC_3i_AND_PP_CMOS_SN74LVC1G11 IN OUT VCC VEE
.PARAM TPDELAY1 = 1N
.PARAM RS = 10K
.PARAM CS = {-TPDELAY1/(RS*LOG(0.5))}
ETPDNORM NTPDNORM VEE TABLE {V(VCC,VEE)} =
+(1.8,4.3)
+(2.5,2.6)
+(3.3,2.15)
+(5,1.95)
G1 IN N1 VALUE = {V(IN,N1)/(V(NTPDNORM,VEE)*RS)}
RZ IN N1 10G
C1 N1 VEE {CS}
E1 N2 VEE VALUE = {0.5*(1 + SGN(V(N1,VEE) - 0.5))}
EOUT OUT VEE N2 VEE 1
.ENDS
.SUBCKT LOGIC_PP_OUTPUT_LVC_3i_AND_PP_CMOS_SN74LVC1G11 IN OUT VCC VEE
EROH NROH VEE TABLE {V(VCC,VEE)} =
+(1.65,112.5)
+(2.3,50)
+(3,37.5)
+(4.5,21.875)
EROL NROL VEE TABLE {V(VCC,VEE)} =
+(1.65,112.5)
+(2.3,37.5)
+(3,25)
+(4.5,17.1875)
E1 N1 VEE VALUE = {V(VCC,VEE)*V(IN,VEE)}
GOUT N1 OUT VALUE = {V(N1,OUT)*(V(IN,VEE)/V(NROH,VEE) + (1 - V(IN,VEE))/V(NROL,VEE))}
.ENDS
.SUBCKT LOGIC_ICC_LVC_3i_AND_PP_CMOS_SN74LVC1G11 VCC VEE VIOUT
.PARAM ICC = 2.5e-07
.PARAM VCC_MAX = 5.5
.PARAM VCC_MIN = 1.65
GICC VCC VEE VALUE = {ICC*0.5*(1 + SGN(V(VCC,VEE) - VCC_MIN))}
EGNDF GNDF 0 VALUE = {0.5*(V(VCC) + V(VEE))}
GOUTP VCC GNDF VALUE = {V(VIOUT,VEE)*0.5*(SGN(V(VIOUT,VEE)) + ABS(SGN(V(VIOUT,VEE))))}
GOUTN GNDF VEE VALUE = {V(VIOUT,VEE)*0.5*(SGN(V(VIOUT,VEE)) + ABS(SGN(V(VIOUT,VEE))))}
.ENDS
.MODEL APT2012SURCK D (IS=4.291886e-17 RS=2.353504 N=2.186609 EG=1.405 CJO=35p BV=5 IBV=10u )
.tran 0 10 0 startup uic
.MODEL DI_BAS70 D  ( IS=99.5p RS=0.600 BV=70.0 IBV=10.0u
+ CJO=2.00p  M=0.333 N=1.70 TT=7.20n )
.TEMP -40
.backanno
.end